# Altium project Drone.PrjPcb
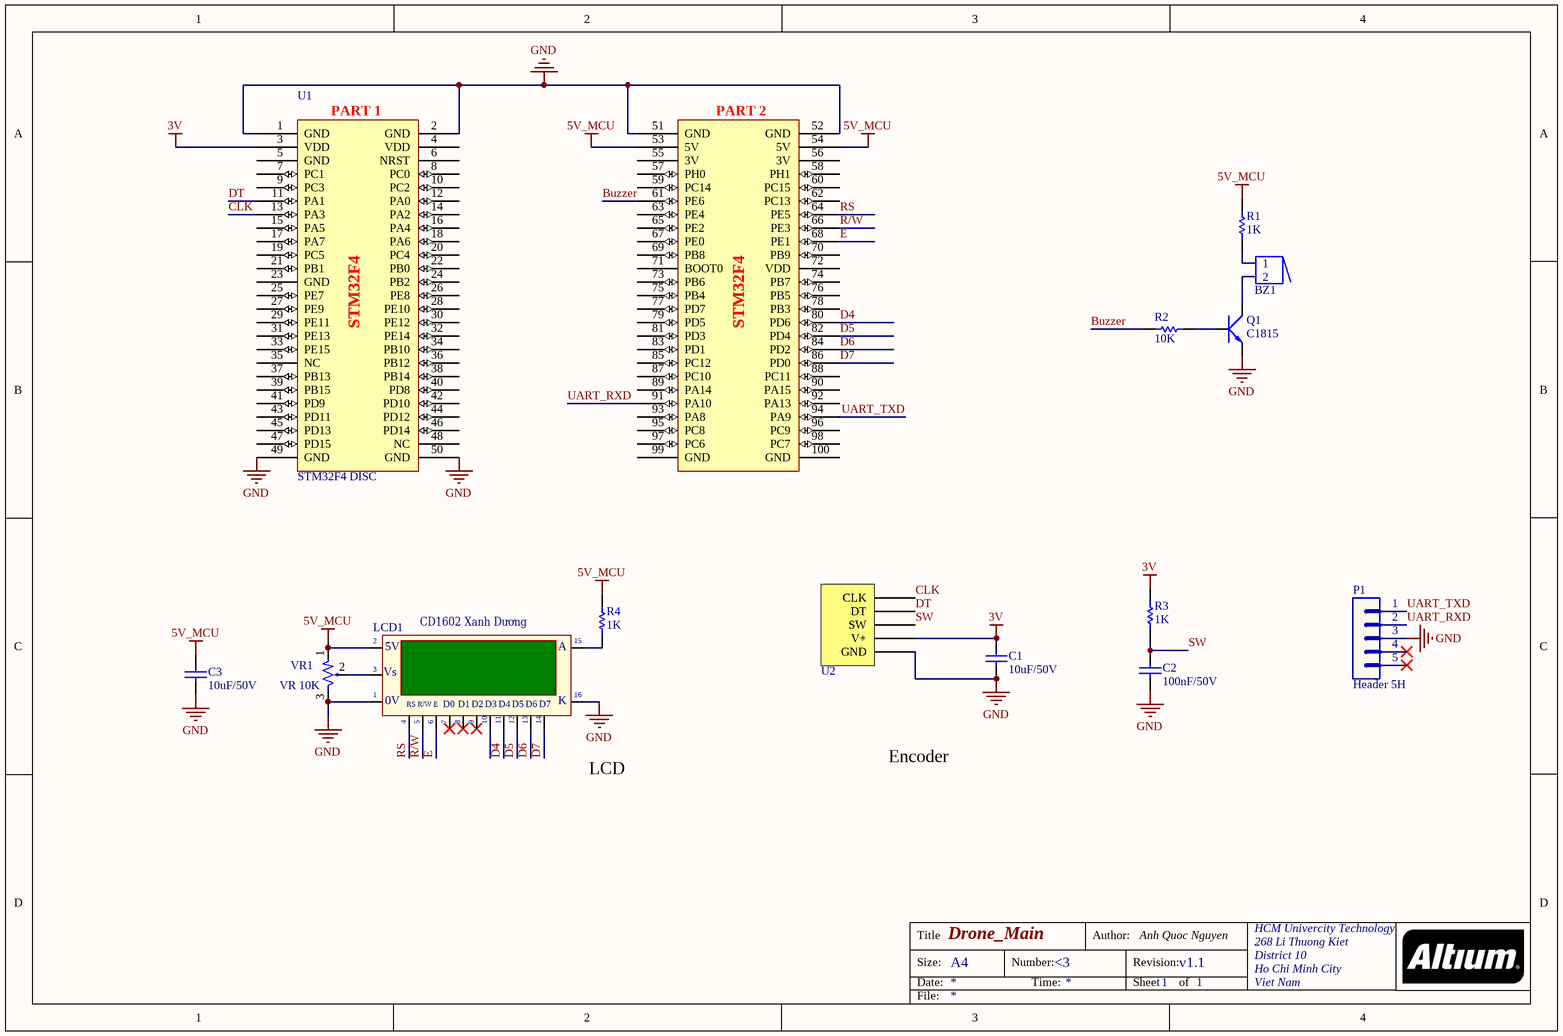
[diagram p0: Drone.SchDoc]
1 sheet, 14 parts. Net scope: global (net labels, ports and power ports of the same name join across sheets).
Board file: Drone.PcbDoc

## Sheet Drone.SchDoc: Drone_Main
size A4; Organization: HCM Univercity Technology; Address1: 268 Li Thuong Kiet; Address2: District 10; Address3: Ho Chi Minh City; Address4: Viet Nam; DocumentNumber: <3; Revision: v1.1; SheetNumber: 1; SheetTotal: 1

### Parts
BZ1  Buzzer  [BUZZER]  (value not drawn)
C1  value 10uF/50V  [CAP-SM-0805]  (hidden comment: Cap-10uF-50V-0805)
C2  value 100nF/50V  [CAP-SM-0805]  (hidden comment: Cap-100nF-50V-0805)
C3  value 10uF/50V  [CAP-SM-0805]  (hidden comment: Cap-10uF-50V-0805)
LCD1  CD1602 Xanh Dương  [LCD16X2]
P1  Header 5H  [JP5H]
Q1  C1815  [QTO-92]
R1  value 1K  [RES-SM-0805]  (hidden comment: Res-1K-0805)
R2  value 10K  [RES-SM-0805]  (hidden comment: Res-10k-0805)
R3  value 1K  [RES-SM-0805]  (hidden comment: Res-1K-0805)
R4  value 1K  [RES-SM-0805]  (hidden comment: Res-1K-0805)
U1  STM32F4 DISC  [STM32F4 DISC]
U2  Rotary Encoder  [Rotary Encoder]  (value not drawn)
VR1  value VR 10K  [Varistor 1]  (hidden comment: 10K)

### Nets
3V: C1.1 R3.2 U1.3(VDD) U2.4(V+)
5V_MCU: C3.1 LCD1.2(VDD) R1.2 R4.2 U1.53(5V) U1.54(5V) VR1.1
GND: C1.2 C2.1 C3.2 LCD1.1(GND) LCD1.16(K) P1.3 Q1.3(E) U1.1(GND) U1.2(GND) U1.49(GND) U1.50(GND) U1.51(GND) U1.52(GND) U2.5(GND) VR1.3
Buzzer: R2.1 U1.61(PE6)
CLK: U1.13(PA3) U2.1(CLK)
D4: LCD1.11(D4) U1.80(PD6)
D5: LCD1.12(D5) U1.82(PD4)
D6: LCD1.13(D6) U1.84(PD2)
D7: LCD1.14(D7) U1.86(PD0)
DT: U1.11(PA1) U2.2(DT)
E: LCD1.6(~{EN}) U1.68(PE1)
R/~{W}: LCD1.5(R/~{W}) U1.66(PE3)
RS: LCD1.4(RS) U1.64(PE5)
SW: C2.2 R3.1 U2.3(SW)
UART_RXD: P1.2 U1.91(PA10)
UART_TXD: P1.1 U1.94(PA9)
NetBZ1_1: BZ1.1 R1.1
NetBZ1_2: BZ1.2 Q1.2(C)
NetLCD1_3: LCD1.3(VEE) VR1.2
NetLCD1_15: LCD1.15(A) R4.1
NetQ1_1: Q1.1(B) R2.2

Not connected (* = marked no-connect by the designer): LCD1 7(D0)* 8(D1)* 9(D2)* 10(D3); P1 4* 5*; U1 4(VDD) 5(GND) 6(NRST) 7(PC1) 8(PC0) 9(PC3) 10(PC2) 12(PA0) 14(PA2) 15(PA5) 16(PA4) 17(PA7) 18(PA6) 19(PC5) 20(PC4) 21(PB1) 22(PB0) 23(GND) 24(PB2) 25(PE7) 26(PE8) 27(PE9) 28(PE10) 29(PE11) 30(PE12) 31(PE13) 32(PE14) 33(PE15) 34(PB10) 35(NC) 36(PB12) 37(PB13) 38(PB14) 39(PB15) 40(PD8) 41(PD9) 42(PD10) 43(PD11) 44(PD12) 45(PD13) 46(PD14) 47(PD15) 48(NC) 55(3V) 56(3V) 57(PH0) 58(PH1) 59(PC14) 60(PC15) 62(PC13) 63(PE4) 65(PE2) 67(PE0) 69(PB8) 70(PB9) 71(BOOT0) 72(VDD) 73(PB6) 74(PB7) 75(PB4) 76(PB5) 77(PD7) 78(PB3) 79(PD5) 81(PD3) 83(PD1) 85(PC12) 87(PC10) 88(PC11) 89(PA14) 90(PA15) 92(PA13) 93(PA8) 95(PC8) 96(PC9) 97(PC6) 98(PC7) 99(GND) 100(GND)

### Notes on the sheet
- (near LCD1) LCD
- Encoder
- Author:
- Anh Quoc Nguyen
- Title
- Size:
- Date:
- A4
- Number:
- Time:
- Revision:
- Sheet
- of
- File:
- (in symbol LCD16x2A) 5V; Vs; |; 0V; R/W; E
- (in symbol STM32F4 DISC) PART 1; PART 2; STM32F4

### Library data of the parts
C1 C3 = Cap-10uF-50V-0805: CAP CER 10UF 50V X5R 0805; Manufacturer: Yageo; Manufacturer Part Number: CC0805KKX5R9BB106; Local Supplier: thegioiic; Local Supplier Link: https://thegioiic.com/products/tu-10uf-50v-0805; Supplier 1: Digikey; Supplier 1 Link: https://www.digikey.com/product-detail/en/yageo/CC0805KKX5R9BB106/311-3499-2-ND/7164383; Supplier 1 Part Number: 311-3499-2-ND
C2 = Cap-100nF-50V-0805: CAP CER 0.1UF 50V Y5V 0805; Manufacturer: Samsung Electro-Mechanics; Manufacturer Part Number: CL21F104ZBCNNNC; Local Supplier: thegioiic; Local Supplier Link: https://thegioiic.com/products/tu-100nf-0-1uf-50v-0805; Supplier 1: Digikey; Supplier 1 Part Number: 1276-1007-1-ND; Supplier 1 Link: https://www.digikey.com/product-detail/en/samsung-electro-mechanics/CL21F104ZBCNNNC/1276-1007-1-ND/3889093
LCD1 = LCD16x2A: Cắm; Ten_Linh_Kien: CD1602 Xanh Dương ( Điện Áp 3.3V); Ma_Hang: MH002827; Don_Vi: Con; Kieu_Chan: *; Ghi _Chu: *; Chung_Loai: Cắm
P1 = Header 5H: Header, 5-Pin, Right Angle; LatestRevisionDate: 17-Jul-2002; LatestRevisionNote: Re-released for DXP Platform.; Publisher: Altium Limited
Q1 = C1815: Dán; Ten_Linh_Kien: C1815 SOT23 TRANS NPN 0.15A 50V (SMD-HF); Don_Vi: Con; Ma_Hang: MH000946; Ghi_Chu: *; Kieu_Chan: *; Chung_Loai: Dán
R1 R3 R4 = Res-1K-0805: RES 1K OHM 1% 1/4W 0805; Manufacturer: Stackpole Electronics Inc; Manufacturer Part Number: RNCP0805FTD1K00; Local Supplier: thegioiic; Local Supplier Link: https://thegioiic.com/products/dien-tro-1k-ohm-0805-5; Supplier 1: Digikey; Supplier 1 Link: https://www.digikey.com/product-detail/en/stackpole-electronics-inc/RNCP0805FTD1K00/RNCP0805FTD1K00CT-ND/2240568; Supplier 1 Part Number: RNCP0805FTD1K00CT-ND
R2 = Res-10k-0805: RES 10K OHM 1% 1/4W 0805; Manufacturer: Stackpole Electronics Inc; Manufacturer Part Number: RNCP0805FTD10K0; Local Supplier: thegioiic; Local Supplier Link: https://thegioiic.com/products/dien-tro-10k-ohm-0805-5; Supplier 1: Digikey; Supplier 1 Link: https://www.digikey.com/product-detail/en/stackpole-electronics-inc/RNCP0805FTD10K0/RNCP0805FTD10K0CT-ND/2240601; Supplier 1 Part Number: RNCP0805FTD10K0CT-ND
U1 = STM32F4 DISC: STM32F4 Discovery board. Chip on Board is Stm32f411VET6. Speed is 150MHz
VR1 = Var Resistor